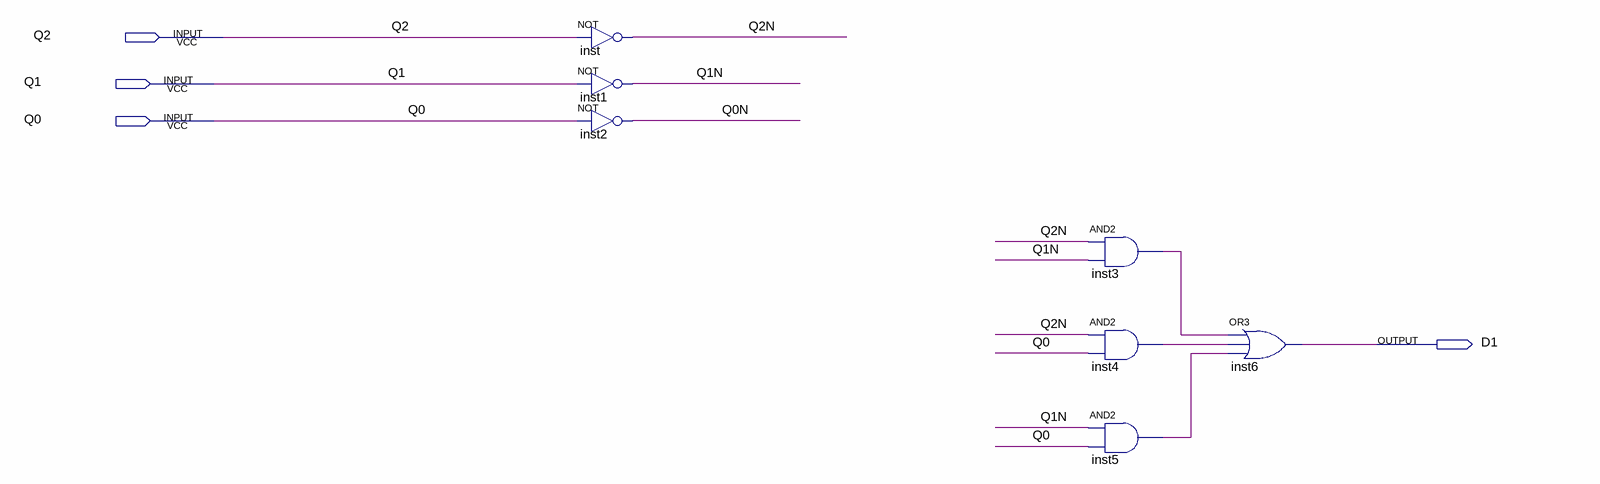
[diagram p0: schematic sheet]
// Quartus schematic D31.bdf as structural Verilog: 7 symbols, 4 pins
module D31 (
  input  Q2,
  input  Q1,
  input  Q0,
  output D1
);

  wire inst3_out, inst4_out, inst5_out, Q0N, Q1N, Q2N;

  not inst (Q2N, Q2);
  not inst1 (Q1N, Q1);
  not inst2 (Q0N, Q0);
  and inst3 (inst3_out, Q2N, Q1N);
  and inst4 (inst4_out, Q2N, Q0);
  and inst5 (inst5_out, Q1N, Q0);
  or inst6 (D1, inst3_out, inst4_out, inst5_out);
endmodule
